# Altium project SR-BMS-Slave-Ver1-RevA.PrjPcb
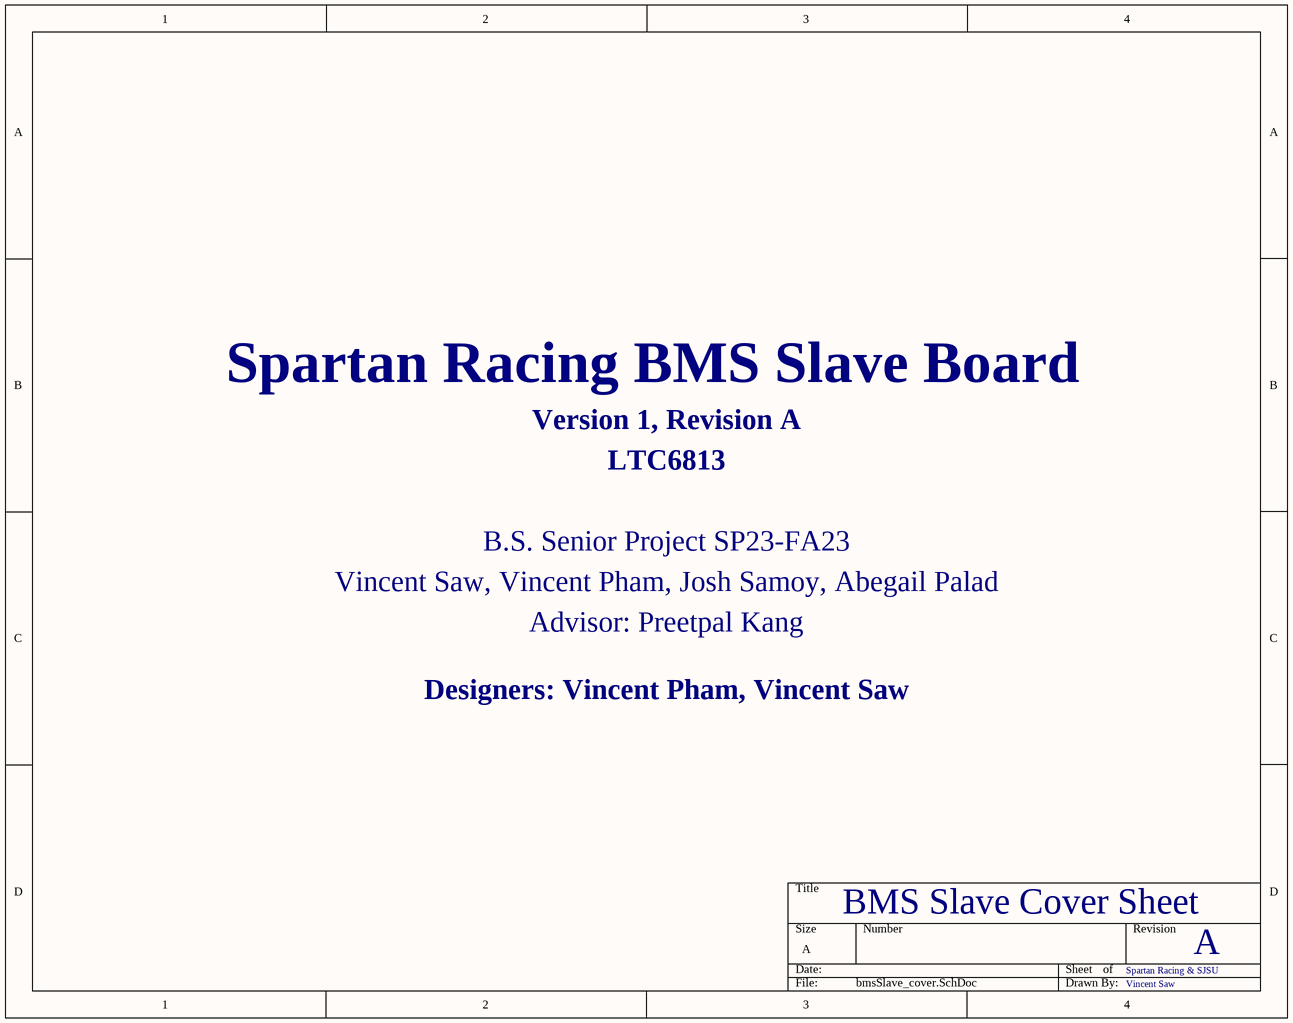
[diagram p0: bmsSlave_cover.SchDoc]
5 sheets, 233 parts. Net scope: global (net labels, ports and power ports of the same name join across sheets).
Board file: bmsSlave.PcbDoc
Sheets:
  bmsSlave_cover.SchDoc
  bmsSlave_main.SchDoc
  bmsSlave_conn.SchDoc
  bmsSlave_cells.SchDoc
  bmsSlave_isospi.SchDoc

## Sheet bmsSlave_cover.SchDoc
size A; SheetNumber: 1; SheetTotal: 5

### Notes on the sheet
- Spartan Racing BMS Slave Board
- Version 1, Revision A
- LTC6813
- B.S. Senior Project SP23-FA23
- Vincent Saw, Vincent Pham, Josh Samoy, Abegail Palad
- Advisor: Preetpal Kang
- Designers: Vincent Pham, Vincent Saw
- BMS Slave Cover Sheet
- Spartan Racing & SJSU
- A
- Vincent Saw

## Sheet bmsSlave_main.SchDoc
size B; SheetNumber: 2; SheetTotal: 4; Designator: R
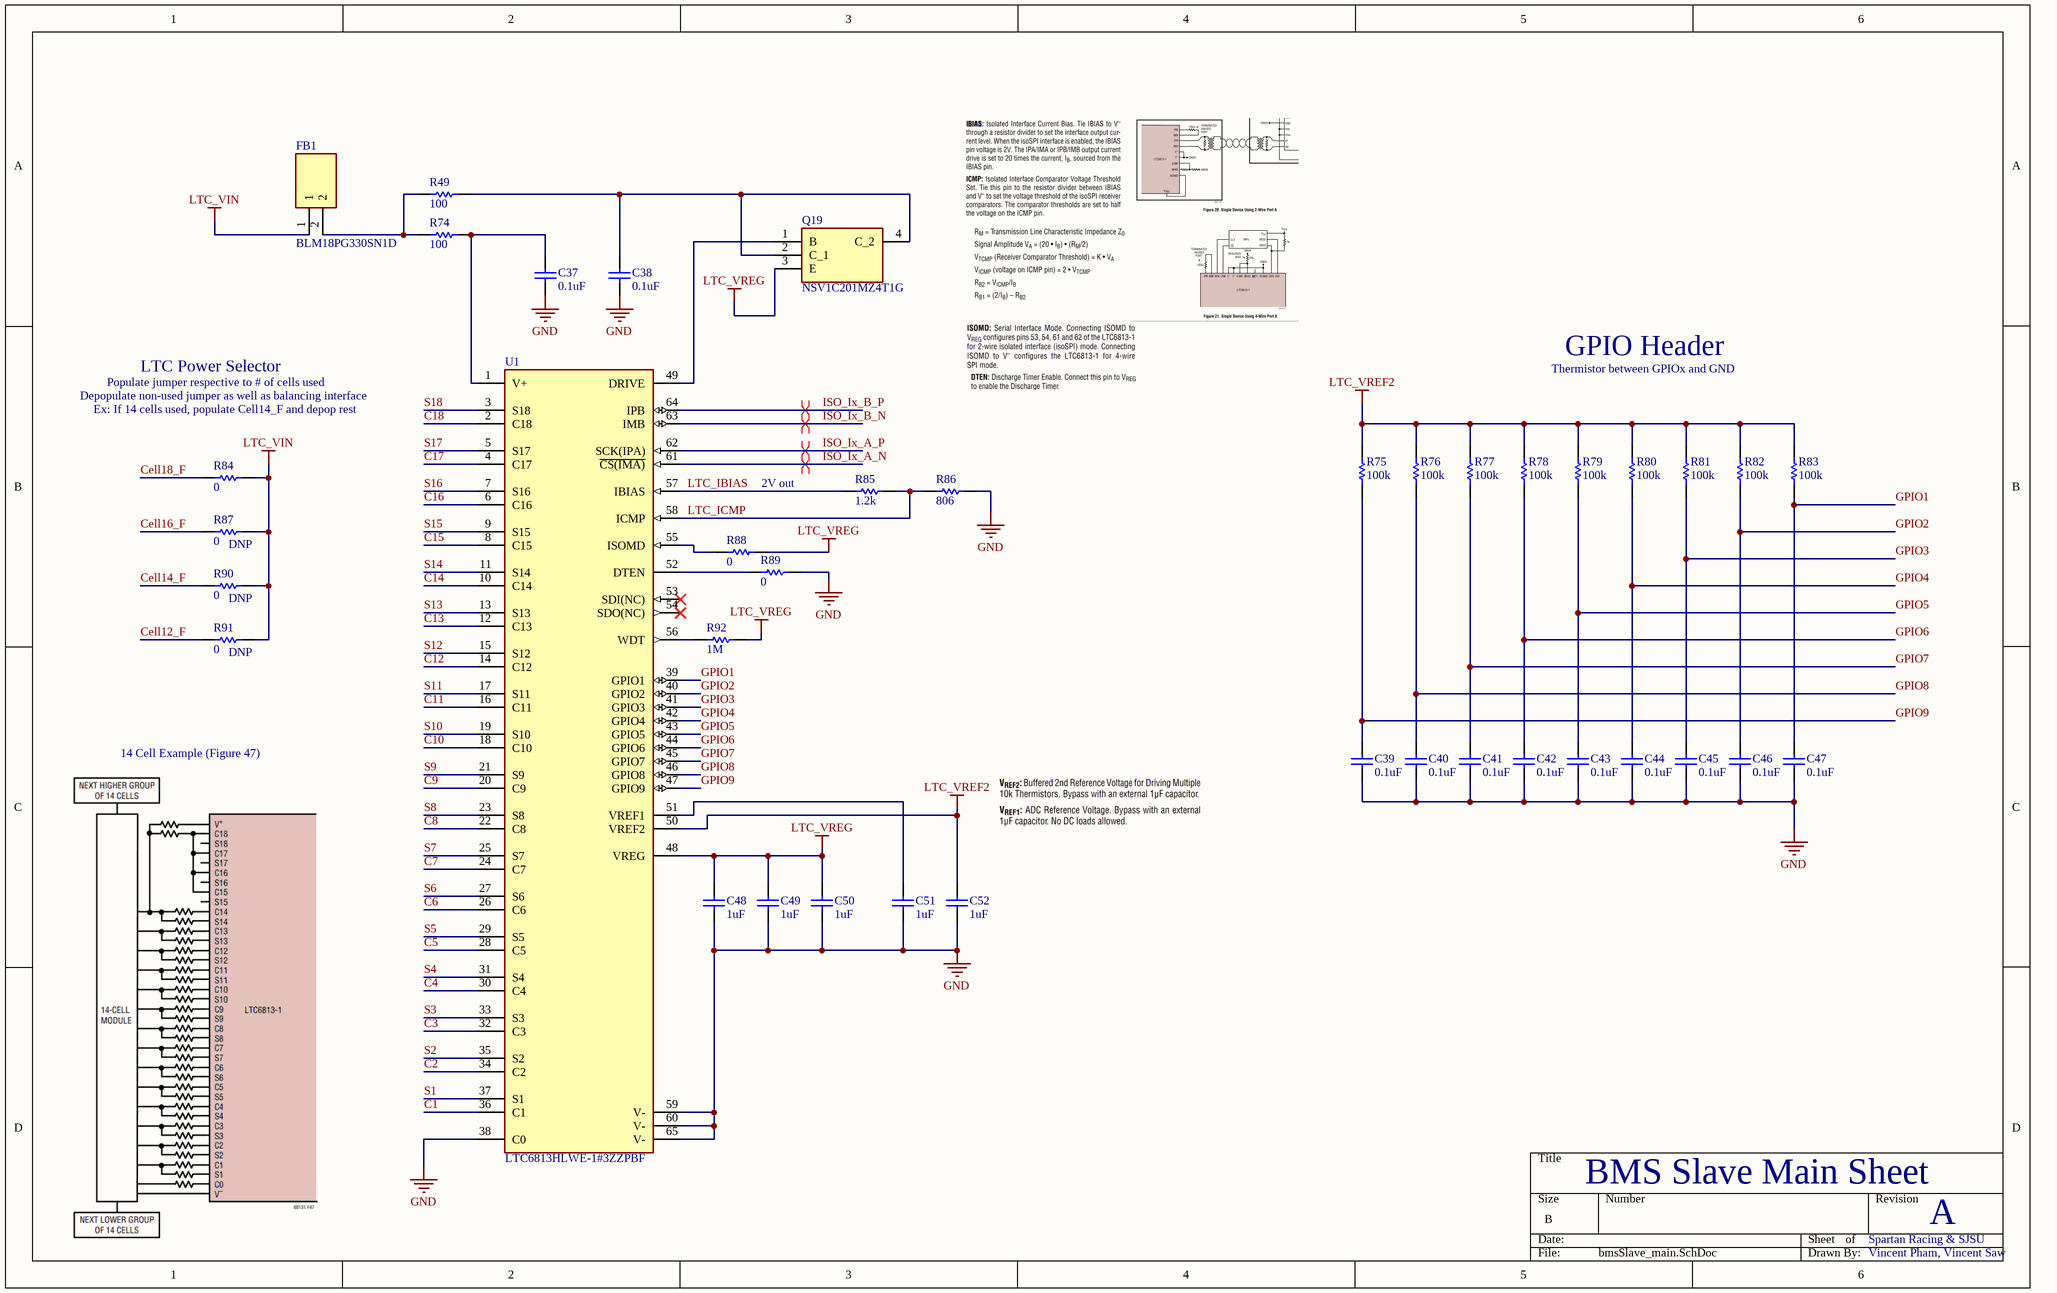
[diagram p1: bmsSlave_main.SchDoc]

### Parts
C37  value 0.1uF  [C0603]  (hidden comment: Capacitor)
C38  value 0.1uF  [C0603]  (hidden comment: Capacitor)
C39  value 0.1uF  [C0603]  (hidden comment: Capacitor)
C40  value 0.1uF  [C0603]  (hidden comment: Capacitor)
C41  value 0.1uF  [C0603]  (hidden comment: Capacitor)
C42  value 0.1uF  [C0603]  (hidden comment: Capacitor)
C43  value 0.1uF  [C0603]  (hidden comment: Capacitor)
C44  value 0.1uF  [C0603]  (hidden comment: Capacitor)
C45  value 0.1uF  [C0603]  (hidden comment: Capacitor)
C46  value 0.1uF  [C0603]  (hidden comment: Capacitor)
C47  value 0.1uF  [C0603]  (hidden comment: Capacitor)
C48  value 1uF  [C0603]  (hidden comment: Capacitor)
C49  value 1uF  [C0603]  (hidden comment: Capacitor)
C50  value 1uF  [C0603]  (hidden comment: Capacitor)
C51  value 1uF  [C0603]  (hidden comment: Capacitor)
C52  value 1uF  [C0603]  (hidden comment: Capacitor)
FB1  BLM18PG330SN1D  [BEADC1608X95N]
Q19  NSV1C201MZ4T1G  [SOT230P700X175-4N]
R49  value 100  [R0603]  (hidden comment: Resistor)
R74  value 100  [R0603]  (hidden comment: Resistor)
R75  value 100k  [R0603]  (hidden comment: Resistor)
R76  value 100k  [R0603]  (hidden comment: Resistor)
R77  value 100k  [R0603]  (hidden comment: Resistor)
R78  value 100k  [R0603]  (hidden comment: Resistor)
R79  value 100k  [R0603]  (hidden comment: Resistor)
R80  value 100k  [R0603]  (hidden comment: Resistor)
R81  value 100k  [R0603]  (hidden comment: Resistor)
R82  value 100k  [R0603]  (hidden comment: Resistor)
R83  value 100k  [R0603]  (hidden comment: Resistor)
R84  value 0  [R0603]  (hidden comment: Resistor)
R85  value 1.2k  [R0603]  (hidden comment: Resistor)
R86  value 806  [R0603]  (hidden comment: Resistor)
R87  value 0  [R0603]  (hidden comment: Resistor)
R88  value 0  [R0603]  (hidden comment: Resistor)
R89  value 0  [R0603]  (hidden comment: Resistor)
R90  value 0  [R0603]  (hidden comment: Resistor)
R91  value 0  [R0603]  (hidden comment: Resistor)
R92  value 1M  [R0603]  (hidden comment: Resistor)
U1  LTC6813HLWE-1#3ZZPBF  [FP-LWE-64-05-08-1982-MFG]

### Nets
GND: C37.2 C38.2 C39.2 C40.2 C41.2 C42.2 C43.2 C44.2 C45.2 C46.2 C47.2 C48.2 C49.2 C50.2 C51.2 C52.2 R86.2 R89.1 U1.38(C0) U1.59(V-) U1.60(V-) U1.65(V-)
LTC_VIN: FB1.1 R84.2 R87.2 R90.2 R91.2
LTC_VREF2: C52.1 R75.2 R76.2 R77.2 R78.2 R79.2 R80.2 R81.2 R82.2 R83.2 U1.50(VREF2)
LTC_VREG: C48.1 C49.1 C50.1 Q19.3(E) R88.1 R92.1 U1.48(VREG)
C1: U1.36(C1)
C2: U1.34(C2)
C3: U1.32(C3)
C4: U1.30(C4)
C5: U1.28(C5)
C6: U1.26(C6)
C7: U1.24(C7)
C8: U1.22(C8)
C9: U1.20(C9)
C10: U1.18(C10)
C11: U1.16(C11)
C12: U1.14(C12)
C13: U1.12(C13)
C14: U1.10(C14)
C15: U1.8(C15)
C16: U1.6(C16)
C17: U1.4(C17)
C18: U1.2(C18)
Cell12_F: R91.1
Cell14_F: R90.1
Cell16_F: R87.1
Cell18_F: R84.1
GPIO1: C47.1 R83.1 U1.39(GPIO1)
GPIO2: C46.1 R82.1 U1.40(GPIO2)
GPIO3: C45.1 R81.1 U1.41(GPIO3)
GPIO4: C44.1 R80.1 U1.42(GPIO4)
GPIO5: C43.1 R79.1 U1.43(GPIO5)
GPIO6: C42.1 R78.1 U1.44(GPIO6)
GPIO7: C41.1 R77.1 U1.45(GPIO7)
GPIO8: C40.1 R76.1 U1.46(GPIO8)
GPIO9: C39.1 R75.1 U1.47(GPIO9)
ISO_Ix_A_N: U1.61(~{CS(IMA)})
ISO_Ix_A_P: U1.62(SCK(IPA))
ISO_Ix_B_N: U1.63(IMB)
ISO_Ix_B_P: U1.64(IPB)
LTC_IBIAS: R85.2 U1.57(IBIAS)
LTC_ICMP: R85.1 R86.1 U1.58(ICMP)
S1: U1.37(S1)
S2: U1.35(S2)
S3: U1.33(S3)
S4: U1.31(S4)
S5: U1.29(S5)
S6: U1.27(S6)
S7: U1.25(S7)
S8: U1.23(S8)
S9: U1.21(S9)
S10: U1.19(S10)
S11: U1.17(S11)
S12: U1.15(S12)
S13: U1.13(S13)
S14: U1.11(S14)
S15: U1.9(S15)
S16: U1.7(S16)
S17: U1.5(S17)
S18: U1.3(S18)
NetC37_1: C37.1 R74.2 U1.1(V+)
NetC38_1: C38.1 Q19.2(C_1) Q19.4(C_2) R49.2
NetC51_1: C51.1 U1.51(VREF1)
NetFB1_2: FB1.2 R49.1 R74.1
NetQ19_1: Q19.1(B) U1.49(DRIVE)
NetR88_2: R88.2 U1.55(ISOMD)
NetR89_2: R89.2 U1.52(DTEN)
NetR92_2: R92.2 U1.56(WDT)

Not connected (* = marked no-connect by the designer): U1 53(SDI(NC))* 54(SDO(NC))*

### Layout directives
differential pair: ISO_Ix_A_N, ISO_Ix_A_P, ISO_Ix_B_N, ISO_Ix_B_P

### Notes on the sheet
- LTC Power Selector
- Thermistor between GPIOx and GND
- GPIO Header
- Depopulate non-used jumper as well as balancing interface
- Ex: If 14 cells used, populate Cell14_F and depop rest
- Populate jumper respective to # of cells used
- 2V out
- (near R87) DNP
- (near R90) DNP
- (near R91) DNP
- 14 Cell Example (Figure 47)
- BMS Slave Main Sheet
- Spartan Racing & SJSU
- A
- Vincent Pham, Vincent Saw

### Library data of the parts
C37-C52 = Capacitor: SimulationGenericComponent: True
FB1 = BLM18PG330SN1D: Ferrite Bead; Manufacturer_Name: Murata Electronics; Datasheet Link: http://www.murata.com/~/media/webrenewal/support/library/catalog/products/emc/emifil/c31e.ashx?la=en-gb; Height: 0.95mm; Manufacturer_Part_Number: BLM18PG330SN1D; Mouser Part Number: 81-BLM18PG330SN1D; Mouser Price/Stock: https://www.mouser.co.uk/ProductDetail/Murata-Electronics/BLM18PG330SN1D?qs=4Avc3lXqH4bdltMAIp8Scg%3D%3D; Arrow Part Number: BLM18PG330SN1D; Arrow Price/Stock: https://www.arrow.com/en/products/blm18pg330sn1d/murata-manufacturing?region=nac
Q19 = NSV1C201MZ4T1G: Transistor; Manufacturer_Name: onsemi; Datasheet Link: http://www.onsemi.com/pub/Collateral/NSS1C201MZ4-D.PDF; Height: 1.75mm; Manufacturer_Part_Number: NSV1C201MZ4T1G; Mouser Part Number: 863-NSV1C201MZ4T1G; Mouser Price/Stock: https://www.mouser.co.uk/ProductDetail/onsemi/NSV1C201MZ4T1G?qs=abmNkq9no6CNkkQTLXtvJQ%3D%3D; Arrow Part Number: NSV1C201MZ4T1G; Arrow Price/Stock: https://www.arrow.com/en/products/nsv1c201mz4t1g/on-semiconductor
R49 R74-R83 R85 R86 R92 = Resistor: TC1: 0; SimulationGenericComponent: True; TC2: 0
R84 R87-R91 = Resistor: SimulationGenericComponent: True; TC1: 0; TC2: 0
U1 = CMP-09132-000002-1: 18 CHANNEL MULTICELL BATTERY STA; Manufacturer: Analog Devices; Number Of Outputs: 1; Min Supply Voltage: 2.7V; Max Junction Temp: +125°C; Number Of Cells: 18; Output Voltage: 5.7V; Standoff Height: 0.05mm; Nominal Supply Current: 3-6.1uA; Automotive Grade: Grade 1; Max Supply Voltage: 3.6V; Temperature: -40°C to +125°C; Temperature Range Low: -40°C; Lead Free: Yes; Device Class L1: Integrated Circuits (ICs); ComponentLink2Description: Datasheet; ComponentLink2URL: https://www.analog.com/media/en/technical-documentation/data-sheets/LTC6813-1.pdf; Height: 1.6mm; Package: LWE-64-05-08-1982; Digikey Description: 18 CHANNEL MULTICELL BATTERY STA; RoHS: TRUE; Category: IC; Octopart: https://octopart.com/ltc6813hlwe-1%233zzpbf-analog+devices-90390400; Temperature Range High: +125°C; Automotive: Yes; Manufacturer Part Number: LTC6813HLWE-1#3ZZPBF; Device Class L3: Battery Management; Device Class L2: Power Management ICs; Ipc Land Pattern Name: QFP50P1200X1200X160-64

## Sheet bmsSlave_conn.SchDoc
size A; SheetNumber: 2; SheetTotal: 4
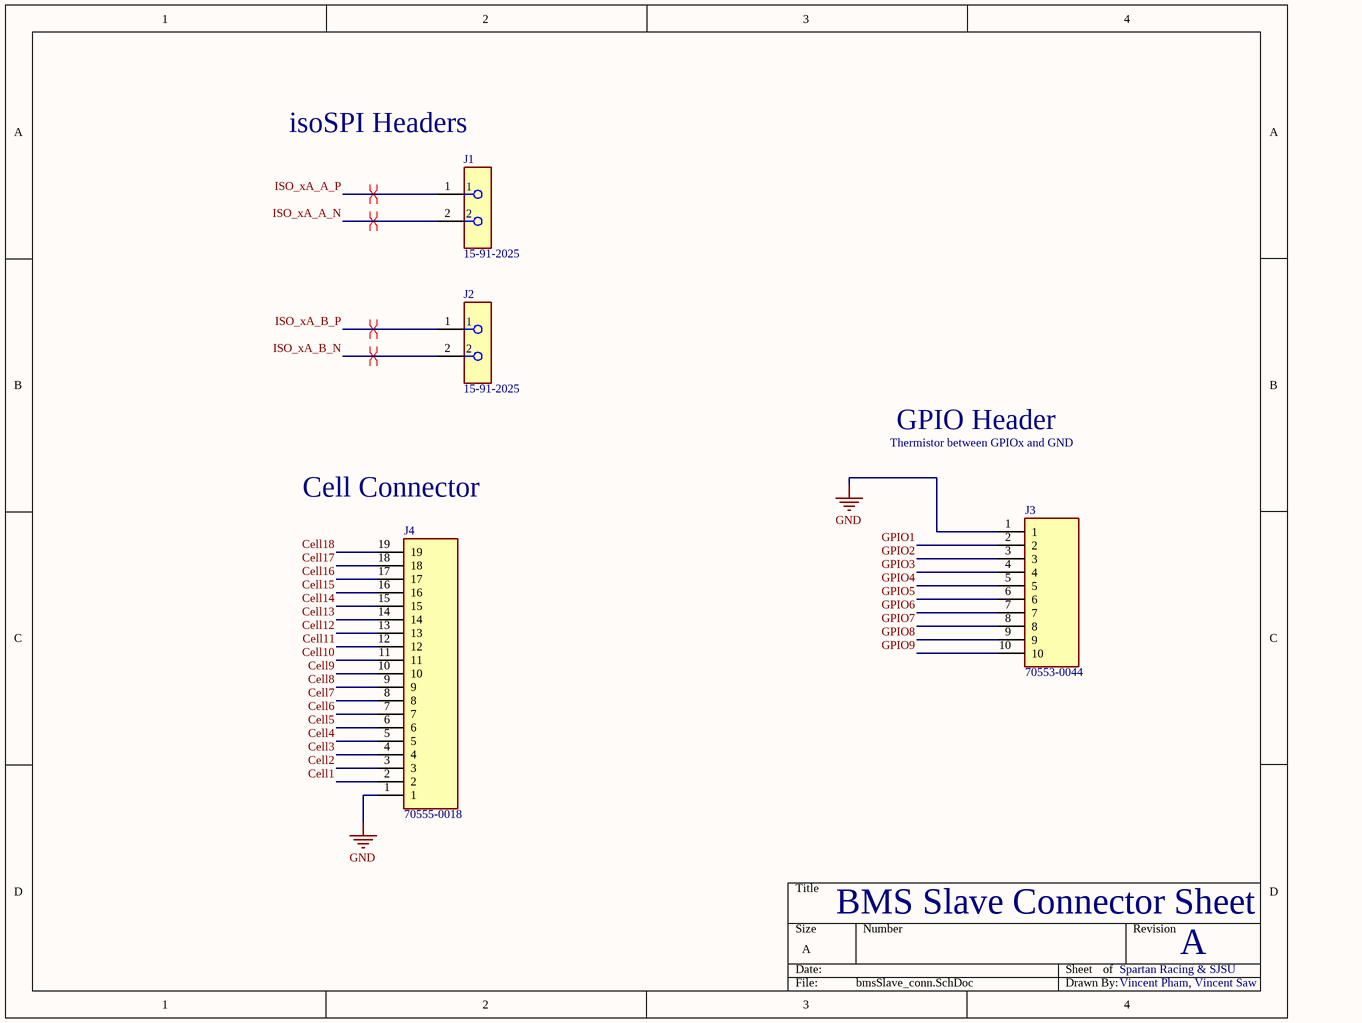
[diagram p2: bmsSlave_conn.SchDoc]

### Parts
J1  15-91-2025  [FP-15-91-2025-MFG]
J2  15-91-2025  [FP-15-91-2025-MFG]
J3  70553-0044  [705550044]
J4  70555-0018  [705550018]

### Nets
GND: J3.1 J4.1
Cell1: J4.2
Cell2: J4.3
Cell3: J4.4
Cell4: J4.5
Cell5: J4.6
Cell6: J4.7
Cell7: J4.8
Cell8: J4.9
Cell9: J4.10
Cell10: J4.11
Cell11: J4.12
Cell12: J4.13
Cell13: J4.14
Cell14: J4.15
Cell15: J4.16
Cell16: J4.17
Cell17: J4.18
Cell18: J4.19
GPIO1: J3.2
GPIO2: J3.3
GPIO3: J3.4
GPIO4: J3.5
GPIO5: J3.6
GPIO6: J3.7
GPIO7: J3.8
GPIO8: J3.9
GPIO9: J3.10
ISO_xA_A_N: J1.2
ISO_xA_A_P: J1.1
ISO_xA_B_N: J2.2
ISO_xA_B_P: J2.1

### Layout directives
differential pair: ISO_xA_A_N, ISO_xA_A_P, ISO_xA_B_N, ISO_xA_B_P

### Notes on the sheet
- isoSPI Headers
- GPIO Header
- (near J4) Cell Connector
- Thermistor between GPIOx and GND
- BMS Slave Connector Sheet
- Spartan Racing & SJSU
- A
- Vincent Pham, Vincent Saw

### Library data of the parts
J1 J2 = CMP-04776-000618-1: CONN HEADER SMD R/A 2POS 2.54MM; Number of Contacts: 2; Voltage Rating: 250V; Max Current Rating: 1.75A; Contact Resistance: 30mR; Current Rating: 3A; Insulation Resistance: 1GR; Gender: Male; Glow Wire Compliant: Non-compliant; Contact Mating Length: 0.24inch; Max Operating Temperature: 105°C; Length: 8.64mm; Color: Black; REACH SVHC: No SVHC; Depth: 13.59mm; ELV: Compliant; Material: Brass; Contact Type: Male Pin; Number of Rows: 1; Number of Positions: 2; Housing Color: Black; Pitch: 2.54mm; Housing Material: Polyester; Flammability Rating: UL94 V-0; Packaging: Rail/Tube; RoHS Compliant: Yes; Radiation Hardening: No; Min Operating Temperature: -40°C; Termination: Solder; Mount: Surface Mount; Contact Plating: Gold; Package Quantity: 1830; Height: 5.56mm; Contact Material: Bronze; Orientation: Right Angle; Number of Circuits: 2; Lead Free: Contains Lead; Voltage Rating (DC): 250V; Series: C-Grid® SL™ 70634; Contact Gender: Male
J3 = 70553-0044: Connector; Manufacturer_Name: Molex; Datasheet Link: https://www.molex.com/pdm_docs/sd/705530044_sd.pdf; Height: 7.12mm; Manufacturer_Part_Number: 70553-0044; Mouser Part Number: 538-70553-0044; Mouser Price/Stock: https://www.mouser.co.uk/ProductDetail/Molex/70553-0044?qs=MYfYmQ4RRgbAysUAVOcSCQ%3D%3D
J4 = 70555-0018: Connector; Manufacturer_Name: Molex; Datasheet Link: https://www.molex.com/pdm_docs/sd/705550018_sd.pdf; Height: 7mm; Manufacturer_Part_Number: 70555-0018

## Sheet bmsSlave_cells.SchDoc
size B; SheetNumber: 3; SheetTotal: 4
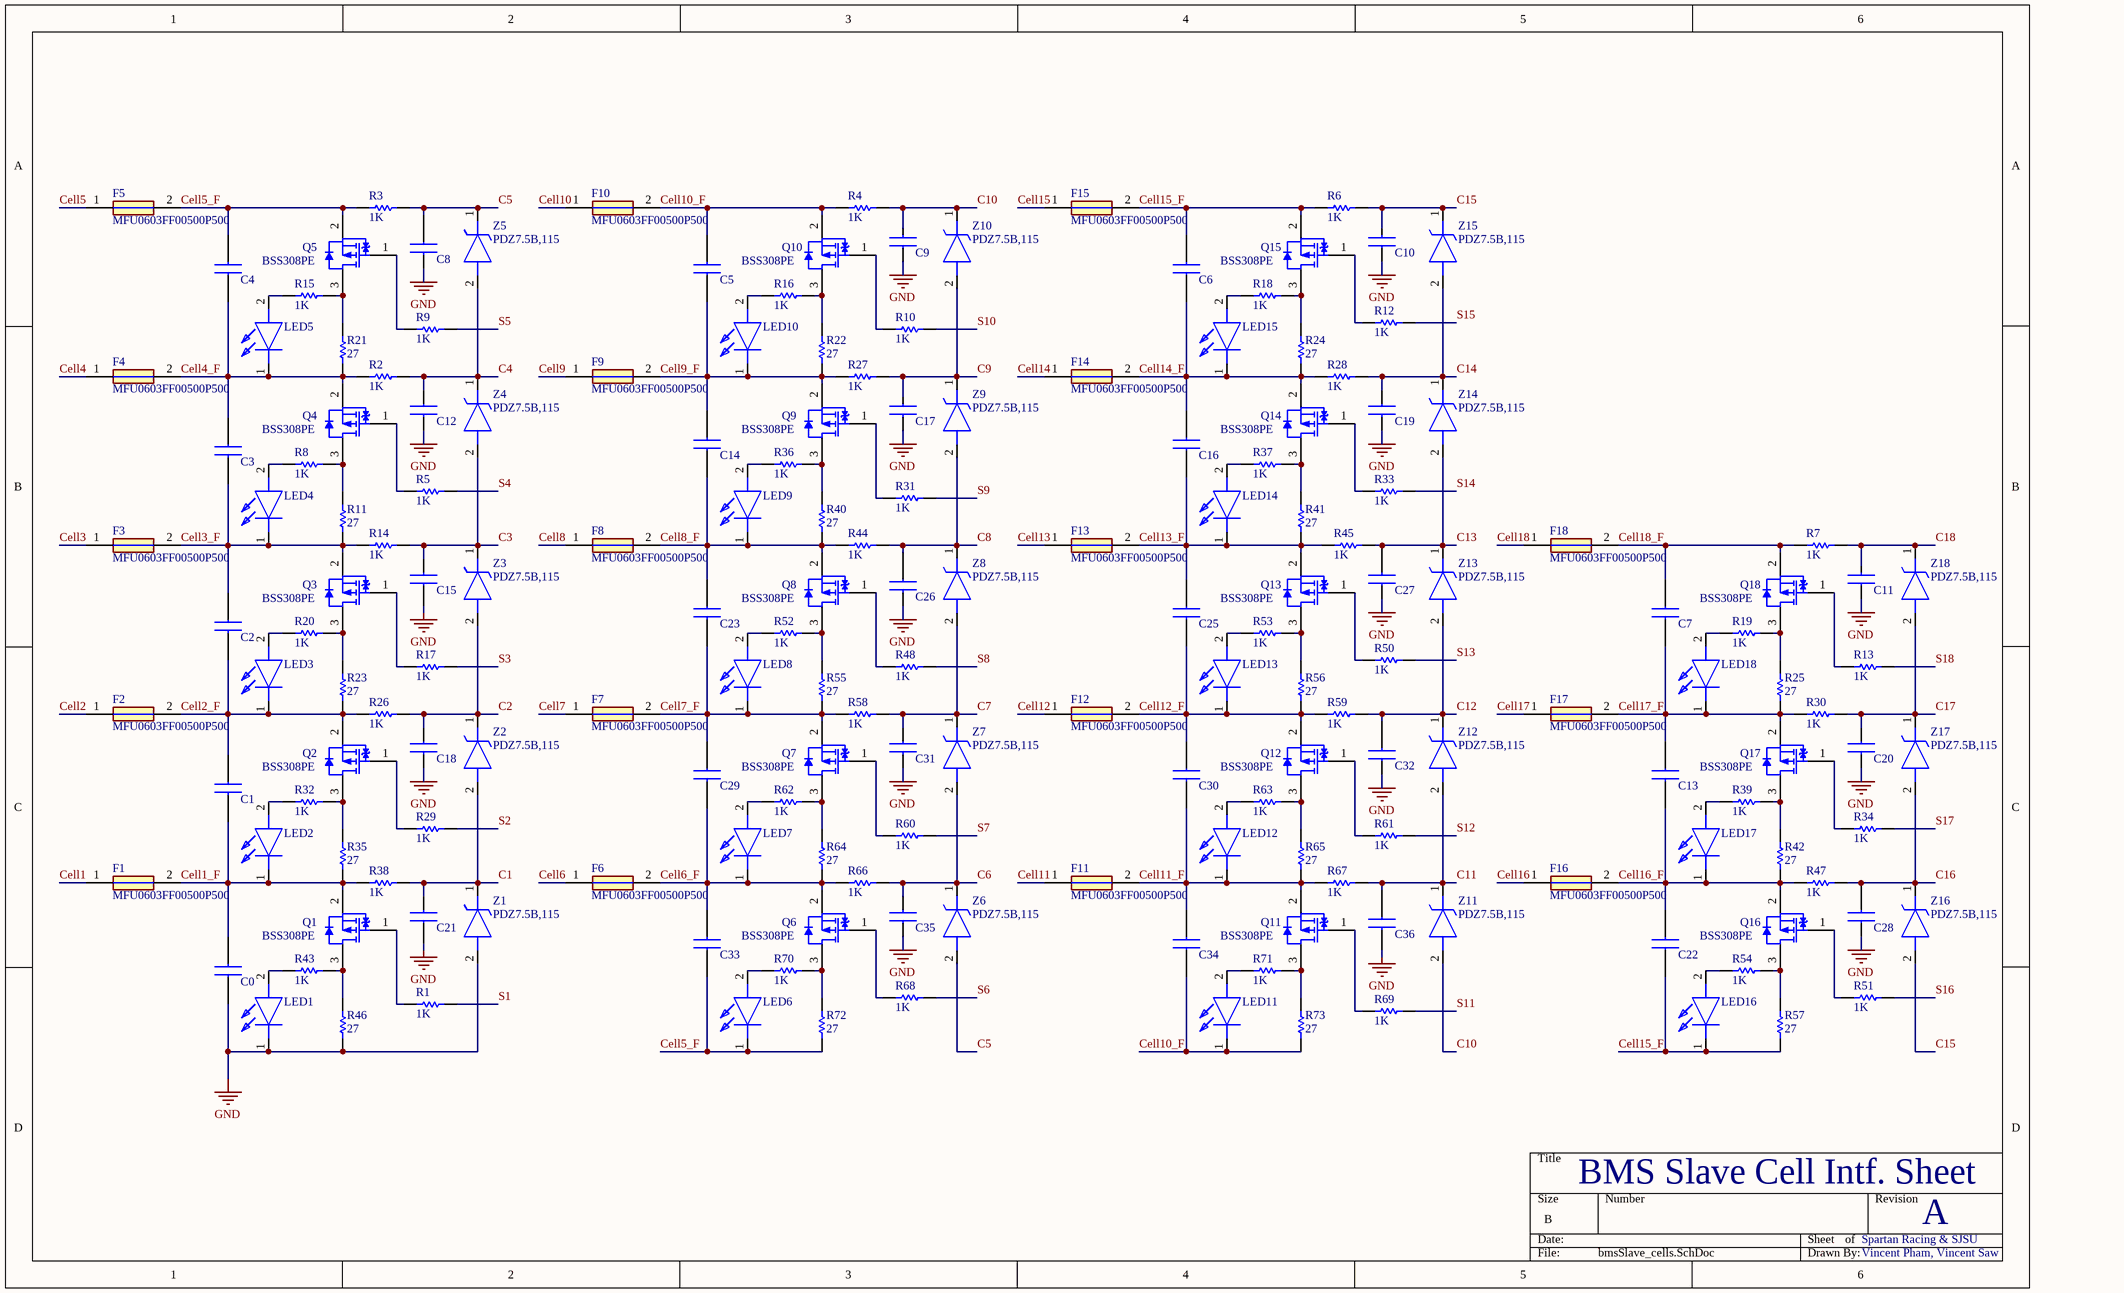
[diagram p3: bmsSlave_cells.SchDoc]

### Parts
C0  885382207009  [C0603]  (value not drawn)
C1  885382207009  [C0603]  (value not drawn)
C2  885382207009  [C0603]  (value not drawn)
C3  885382207009  [C0603]  (value not drawn)
C4  885382207009  [C0603]  (value not drawn)
C5  885382207009  [C0603]  (value not drawn)
C6  885382207009  [C0603]  (value not drawn)
C7  885382207009  [C0603]  (value not drawn)
C8  885382207009  [C0603]  (value not drawn)
C9  885382207009  [C0603]  (value not drawn)
C10  885382207009  [C0603]  (value not drawn)
C11  885382207009  [C0603]  (value not drawn)
C12  885382207009  [C0603]  (value not drawn)
C13  885382207009  [C0603]  (value not drawn)
C14  885382207009  [C0603]  (value not drawn)
C15  885382207009  [C0603]  (value not drawn)
C16  885382207009  [C0603]  (value not drawn)
C17  885382207009  [C0603]  (value not drawn)
C18  885382207009  [C0603]  (value not drawn)
C19  885382207009  [C0603]  (value not drawn)
C20  885382207009  [C0603]  (value not drawn)
C21  885382207009  [C0603]  (value not drawn)
C22  885382207009  [C0603]  (value not drawn)
C23  885382207009  [C0603]  (value not drawn)
C25  885382207009  [C0603]  (value not drawn)
C26  885382207009  [C0603]  (value not drawn)
C27  885382207009  [C0603]  (value not drawn)
C28  885382207009  [C0603]  (value not drawn)
C29  885382207009  [C0603]  (value not drawn)
C30  885382207009  [C0603]  (value not drawn)
C31  885382207009  [C0603]  (value not drawn)
C32  885382207009  [C0603]  (value not drawn)
C33  885382207009  [C0603]  (value not drawn)
C34  885382207009  [C0603]  (value not drawn)
C35  885382207009  [C0603]  (value not drawn)
C36  885382207009  [C0603]  (value not drawn)
F1  MFU0603FF00500P500  [FUSC1608X55N]
F2  MFU0603FF00500P500  [FUSC1608X55N]
F3  MFU0603FF00500P500  [FUSC1608X55N]
F4  MFU0603FF00500P500  [FUSC1608X55N]
F5  MFU0603FF00500P500  [FUSC1608X55N]
F6  MFU0603FF00500P500  [FUSC1608X55N]
F7  MFU0603FF00500P500  [FUSC1608X55N]
F8  MFU0603FF00500P500  [FUSC1608X55N]
F9  MFU0603FF00500P500  [FUSC1608X55N]
F10  MFU0603FF00500P500  [FUSC1608X55N]
F11  MFU0603FF00500P500  [FUSC1608X55N]
F12  MFU0603FF00500P500  [FUSC1608X55N]
F13  MFU0603FF00500P500  [FUSC1608X55N]
F14  MFU0603FF00500P500  [FUSC1608X55N]
F15  MFU0603FF00500P500  [FUSC1608X55N]
F16  MFU0603FF00500P500  [FUSC1608X55N]
F17  MFU0603FF00500P500  [FUSC1608X55N]
F18  MFU0603FF00500P500  [FUSC1608X55N]
LED1  LS_L29K-G1H2-1  [LEDC1308X67N]  (value not drawn)
LED2  LS_L29K-G1H2-1  [LEDC1308X67N]  (value not drawn)
LED3  LS_L29K-G1H2-1  [LEDC1308X67N]  (value not drawn)
LED4  LS_L29K-G1H2-1  [LEDC1308X67N]  (value not drawn)
LED5  LS_L29K-G1H2-1  [LEDC1308X67N]  (value not drawn)
LED6  LS_L29K-G1H2-1  [LEDC1308X67N]  (value not drawn)
LED7  LS_L29K-G1H2-1  [LEDC1308X67N]  (value not drawn)
LED8  LS_L29K-G1H2-1  [LEDC1308X67N]  (value not drawn)
LED9  LS_L29K-G1H2-1  [LEDC1308X67N]  (value not drawn)
LED10  LS_L29K-G1H2-1  [LEDC1308X67N]  (value not drawn)
LED11  LS_L29K-G1H2-1  [LEDC1308X67N]  (value not drawn)
LED12  LS_L29K-G1H2-1  [LEDC1308X67N]  (value not drawn)
LED13  LS_L29K-G1H2-1  [LEDC1308X67N]  (value not drawn)
LED14  LS_L29K-G1H2-1  [LEDC1308X67N]  (value not drawn)
LED15  LS_L29K-G1H2-1  [LEDC1308X67N]  (value not drawn)
LED16  LS_L29K-G1H2-1  [LEDC1308X67N]  (value not drawn)
LED17  LS_L29K-G1H2-1  [LEDC1308X67N]  (value not drawn)
LED18  LS_L29K-G1H2-1  [LEDC1308X67N]  (value not drawn)
Q1  BSS308PE  [INF-PG-SOT23_L]
Q2  BSS308PE  [INF-PG-SOT23_L]
Q3  BSS308PE  [INF-PG-SOT23_L]
Q4  BSS308PE  [INF-PG-SOT23_L]
Q5  BSS308PE  [INF-PG-SOT23_L]
Q6  BSS308PE  [INF-PG-SOT23_L]
Q7  BSS308PE  [INF-PG-SOT23_L]
Q8  BSS308PE  [INF-PG-SOT23_L]
Q9  BSS308PE  [INF-PG-SOT23_L]
Q10  BSS308PE  [INF-PG-SOT23_L]
Q11  BSS308PE  [INF-PG-SOT23_L]
Q12  BSS308PE  [INF-PG-SOT23_L]
Q13  BSS308PE  [INF-PG-SOT23_L]
Q14  BSS308PE  [INF-PG-SOT23_L]
Q15  BSS308PE  [INF-PG-SOT23_L]
Q16  BSS308PE  [INF-PG-SOT23_L]
Q17  BSS308PE  [INF-PG-SOT23_L]
Q18  BSS308PE  [INF-PG-SOT23_L]
R1  value 1K  [R0603]  (hidden comment: Resistor)
R2  value 1K  [R0603]  (hidden comment: Resistor)
R3  value 1K  [R0603]  (hidden comment: Resistor)
R4  value 1K  [R0603]  (hidden comment: Resistor)
R5  value 1K  [R0603]  (hidden comment: Resistor)
R6  value 1K  [R0603]  (hidden comment: Resistor)
R7  value 1K  [R0603]  (hidden comment: Resistor)
R8  value 1K  [R0603]  (hidden comment: Resistor)
R9  value 1K  [R0603]  (hidden comment: Resistor)
R10  value 1K  [R0603]  (hidden comment: Resistor)
R11  value 27  [R2512]  (hidden comment: Resistor)
R12  value 1K  [R0603]  (hidden comment: Resistor)
R13  value 1K  [R0603]  (hidden comment: Resistor)
R14  value 1K  [R0603]  (hidden comment: Resistor)
R15  value 1K  [R0603]  (hidden comment: Resistor)
R16  value 1K  [R0603]  (hidden comment: Resistor)
R17  value 1K  [R0603]  (hidden comment: Resistor)
R18  value 1K  [R0603]  (hidden comment: Resistor)
R19  value 1K  [R0603]  (hidden comment: Resistor)
R20  value 1K  [R0603]  (hidden comment: Resistor)
R21  value 27  [R2512]  (hidden comment: Resistor)
R22  value 27  [R2512]  (hidden comment: Resistor)
R23  value 27  [R2512]  (hidden comment: Resistor)
R24  value 27  [R2512]  (hidden comment: Resistor)
R25  value 27  [R2512]  (hidden comment: Resistor)
R26  value 1K  [R0603]  (hidden comment: Resistor)
R27  value 1K  [R0603]  (hidden comment: Resistor)
R28  value 1K  [R0603]  (hidden comment: Resistor)
R29  value 1K  [R0603]  (hidden comment: Resistor)
R30  value 1K  [R0603]  (hidden comment: Resistor)
R31  value 1K  [R0603]  (hidden comment: Resistor)
R32  value 1K  [R0603]  (hidden comment: Resistor)
R33  value 1K  [R0603]  (hidden comment: Resistor)
R34  value 1K  [R0603]  (hidden comment: Resistor)
R35  value 27  [R2512]  (hidden comment: Resistor)
R36  value 1K  [R0603]  (hidden comment: Resistor)
R37  value 1K  [R0603]  (hidden comment: Resistor)
R38  value 1K  [R0603]  (hidden comment: Resistor)
R39  value 1K  [R0603]  (hidden comment: Resistor)
R40  value 27  [R2512]  (hidden comment: Resistor)
R41  value 27  [R2512]  (hidden comment: Resistor)
R42  value 27  [R2512]  (hidden comment: Resistor)
R43  value 1K  [R0603]  (hidden comment: Resistor)
R44  value 1K  [R0603]  (hidden comment: Resistor)
R45  value 1K  [R0603]  (hidden comment: Resistor)
R46  value 27  [R2512]  (hidden comment: Resistor)
R47  value 1K  [R0603]  (hidden comment: Resistor)
R48  value 1K  [R0603]  (hidden comment: Resistor)
R50  value 1K  [R0603]  (hidden comment: Resistor)
R51  value 1K  [R0603]  (hidden comment: Resistor)
R52  value 1K  [R0603]  (hidden comment: Resistor)
R53  value 1K  [R0603]  (hidden comment: Resistor)
R54  value 1K  [R0603]  (hidden comment: Resistor)
R55  value 27  [R2512]  (hidden comment: Resistor)
R56  value 27  [R2512]  (hidden comment: Resistor)
R57  value 27  [R2512]  (hidden comment: Resistor)
R58  value 1K  [R0603]  (hidden comment: Resistor)
R59  value 1K  [R0603]  (hidden comment: Resistor)
R60  value 1K  [R0603]  (hidden comment: Resistor)
R61  value 1K  [R0603]  (hidden comment: Resistor)
R62  value 1K  [R0603]  (hidden comment: Resistor)
R63  value 1K  [R0603]  (hidden comment: Resistor)
R64  value 27  [R2512]  (hidden comment: Resistor)
R65  value 27  [R2512]  (hidden comment: Resistor)
R66  value 1K  [R0603]  (hidden comment: Resistor)
R67  value 1K  [R0603]  (hidden comment: Resistor)
R68  value 1K  [R0603]  (hidden comment: Resistor)
R69  value 1K  [R0603]  (hidden comment: Resistor)
R70  value 1K  [R0603]  (hidden comment: Resistor)
R71  value 1K  [R0603]  (hidden comment: Resistor)
R72  value 27  [R2512]  (hidden comment: Resistor)
R73  value 27  [R2512]  (hidden comment: Resistor)
Z1  PDZ7.5B,115  [SOD2512X110N]
Z2  PDZ7.5B,115  [SOD2512X110N]
Z3  PDZ7.5B,115  [SOD2512X110N]
Z4  PDZ7.5B,115  [SOD2512X110N]
Z5  PDZ7.5B,115  [SOD2512X110N]
Z6  PDZ7.5B,115  [SOD2512X110N]
Z7  PDZ7.5B,115  [SOD2512X110N]
Z8  PDZ7.5B,115  [SOD2512X110N]
Z9  PDZ7.5B,115  [SOD2512X110N]
Z10  PDZ7.5B,115  [SOD2512X110N]
Z11  PDZ7.5B,115  [SOD2512X110N]
Z12  PDZ7.5B,115  [SOD2512X110N]
Z13  PDZ7.5B,115  [SOD2512X110N]
Z14  PDZ7.5B,115  [SOD2512X110N]
Z15  PDZ7.5B,115  [SOD2512X110N]
Z16  PDZ7.5B,115  [SOD2512X110N]
Z17  PDZ7.5B,115  [SOD2512X110N]
Z18  PDZ7.5B,115  [SOD2512X110N]

### Nets
GND: C0.1 C8.1 C9.1 C10.1 C11.1 C12.1 C15.1 C17.1 C18.1 C19.1 C20.1 C21.1 C26.1 C27.1 C28.1 C31.1 C32.1 C35.1 C36.1 LED1.1(K) R46.2 Z1.2(A)
C1: C21.2 R38.1 Z1.1(K) Z2.2(A)
C2: C18.2 R26.1 Z2.1(K) Z3.2(A)
C3: C15.2 R14.1 Z3.1(K) Z4.2(A)
C4: C12.2 R2.1 Z4.1(K) Z5.2(A)
C5: C8.2 R3.1 Z5.1(K) Z6.2(A)
C6: C35.2 R66.1 Z6.1(K) Z7.2(A)
C7: C31.2 R58.1 Z7.1(K) Z8.2(A)
C8: C26.2 R44.1 Z8.1(K) Z9.2(A)
C9: C17.2 R27.1 Z9.1(K) Z10.2(A)
C10: C9.2 R4.1 Z10.1(K) Z11.2(A)
C11: C36.2 R67.1 Z11.1(K) Z12.2(A)
C12: C32.2 R59.1 Z12.1(K) Z13.2(A)
C13: C27.2 R45.1 Z13.1(K) Z14.2(A)
C14: C19.2 R28.1 Z14.1(K) Z15.2(A)
C15: C10.2 R6.1 Z15.1(K) Z16.2(A)
C16: C28.2 R47.1 Z16.1(K) Z17.2(A)
C17: C20.2 R30.1 Z17.1(K) Z18.2(A)
C18: C11.2 R7.1 Z18.1(K)
Cell1: F1.1
Cell1_F: C0.2 C1.1 F1.2 LED2.1(K) Q1.2(SOURCE) R35.2 R38.2
Cell2: F2.1
Cell2_F: C1.2 C2.1 F2.2 LED3.1(K) Q2.2(SOURCE) R23.2 R26.2
Cell3: F3.1
Cell3_F: C2.2 C3.1 F3.2 LED4.1(K) Q3.2(SOURCE) R11.2 R14.2
Cell4: F4.1
Cell4_F: C3.2 C4.1 F4.2 LED5.1(K) Q4.2(SOURCE) R2.2 R21.2
Cell5: F5.1
Cell5_F: C4.2 C33.1 F5.2 LED6.1(K) Q5.2(SOURCE) R3.2 R72.2
Cell6: F6.1
Cell6_F: C29.1 C33.2 F6.2 LED7.1(K) Q6.2(SOURCE) R64.2 R66.2
Cell7: F7.1
Cell7_F: C23.1 C29.2 F7.2 LED8.1(K) Q7.2(SOURCE) R55.2 R58.2
Cell8: F8.1
Cell8_F: C14.1 C23.2 F8.2 LED9.1(K) Q8.2(SOURCE) R40.2 R44.2
Cell9: F9.1
Cell9_F: C5.1 C14.2 F9.2 LED10.1(K) Q9.2(SOURCE) R22.2 R27.2
Cell10: F10.1
Cell10_F: C5.2 C34.1 F10.2 LED11.1(K) Q10.2(SOURCE) R4.2 R73.2
Cell11: F11.1
Cell11_F: C30.1 C34.2 F11.2 LED12.1(K) Q11.2(SOURCE) R65.2 R67.2
Cell12: F12.1
Cell12_F: C25.1 C30.2 F12.2 LED13.1(K) Q12.2(SOURCE) R56.2 R59.2
Cell13: F13.1
Cell13_F: C16.1 C25.2 F13.2 LED14.1(K) Q13.2(SOURCE) R41.2 R45.2
Cell14: F14.1
Cell14_F: C6.1 C16.2 F14.2 LED15.1(K) Q14.2(SOURCE) R24.2 R28.2
Cell15: F15.1
Cell15_F: C6.2 C22.1 F15.2 LED16.1(K) Q15.2(SOURCE) R6.2 R57.2
Cell16: F16.1
Cell16_F: C13.1 C22.2 F16.2 LED17.1(K) Q16.2(SOURCE) R42.2 R47.2
Cell17: F17.1
Cell17_F: C7.1 C13.2 F17.2 LED18.1(K) Q17.2(SOURCE) R25.2 R30.2
Cell18: F18.1
Cell18_F: C7.2 F18.2 Q18.2(SOURCE) R7.2
S1: R1.1
S2: R29.1
S3: R17.1
S4: R5.1
S5: R9.1
S6: R68.1
S7: R60.1
S8: R48.1
S9: R31.1
S10: R10.1
S11: R69.1
S12: R61.1
S13: R50.1
S14: R33.1
S15: R12.1
S16: R51.1
S17: R34.1
S18: R13.1
NetLED1_2: LED1.2(A) R43.2
NetLED2_2: LED2.2(A) R32.2
NetLED3_2: LED3.2(A) R20.2
NetLED4_2: LED4.2(A) R8.2
NetLED5_2: LED5.2(A) R15.2
NetLED6_2: LED6.2(A) R70.2
NetLED7_2: LED7.2(A) R62.2
NetLED8_2: LED8.2(A) R52.2
NetLED9_2: LED9.2(A) R36.2
NetLED10_2: LED10.2(A) R16.2
NetLED11_2: LED11.2(A) R71.2
NetLED12_2: LED12.2(A) R63.2
NetLED13_2: LED13.2(A) R53.2
NetLED14_2: LED14.2(A) R37.2
NetLED15_2: LED15.2(A) R18.2
NetLED16_2: LED16.2(A) R54.2
NetLED17_2: LED17.2(A) R39.2
NetLED18_2: LED18.2(A) R19.2
NetQ1_1: Q1.1(GATE) R1.2
NetQ1_3: Q1.3(DRAIN) R43.1 R46.1
NetQ2_1: Q2.1(GATE) R29.2
NetQ2_3: Q2.3(DRAIN) R32.1 R35.1
NetQ3_1: Q3.1(GATE) R17.2
NetQ3_3: Q3.3(DRAIN) R20.1 R23.1
NetQ4_1: Q4.1(GATE) R5.2
NetQ4_3: Q4.3(DRAIN) R8.1 R11.1
NetQ5_1: Q5.1(GATE) R9.2
NetQ5_3: Q5.3(DRAIN) R15.1 R21.1
NetQ6_1: Q6.1(GATE) R68.2
NetQ6_3: Q6.3(DRAIN) R70.1 R72.1
NetQ7_1: Q7.1(GATE) R60.2
NetQ7_3: Q7.3(DRAIN) R62.1 R64.1
NetQ8_1: Q8.1(GATE) R48.2
NetQ8_3: Q8.3(DRAIN) R52.1 R55.1
NetQ9_1: Q9.1(GATE) R31.2
NetQ9_3: Q9.3(DRAIN) R36.1 R40.1
NetQ10_1: Q10.1(GATE) R10.2
NetQ10_3: Q10.3(DRAIN) R16.1 R22.1
NetQ11_1: Q11.1(GATE) R69.2
NetQ11_3: Q11.3(DRAIN) R71.1 R73.1
NetQ12_1: Q12.1(GATE) R61.2
NetQ12_3: Q12.3(DRAIN) R63.1 R65.1
NetQ13_1: Q13.1(GATE) R50.2
NetQ13_3: Q13.3(DRAIN) R53.1 R56.1
NetQ14_1: Q14.1(GATE) R33.2
NetQ14_3: Q14.3(DRAIN) R37.1 R41.1
NetQ15_1: Q15.1(GATE) R12.2
NetQ15_3: Q15.3(DRAIN) R18.1 R24.1
NetQ16_1: Q16.1(GATE) R51.2
NetQ16_3: Q16.3(DRAIN) R54.1 R57.1
NetQ17_1: Q17.1(GATE) R34.2
NetQ17_3: Q17.3(DRAIN) R39.1 R42.1
NetQ18_1: Q18.1(GATE) R13.2
NetQ18_3: Q18.3(DRAIN) R19.1 R25.1

### Notes on the sheet
- BMS Slave Cell Intf. Sheet
- Spartan Racing & SJSU
- A
- Vincent Pham, Vincent Saw

### Library data of the parts
C0-C23 C25-C36 = 885382207009: Multilayer Ceramic Chip Capacitor WCAP-CSST Series 0805 10000pF X7R0805103K100DFCT1S000; Manufacturer_Name: Wurth Elektronik; Geometry.Height: 1.35mm; Mouser Part Number: 710-885382207009; Mouser Price/Stock: https://www.mouser.co.uk/ProductDetail/Wurth-Elektronik/885382207009?qs=0lSvoLzn4L%2FLliJ98PmFYg%3D%3D; Manufacturer_Part_Number: 885382207009; Datasheet Link: https://katalog.we-online.com/pbs/datasheet/885382207009.pdf
F1-F18 = MFU0603FF00500P500: Fuse; Manufacturer_Name: Vishay; Datasheet Link: https://componentsearchengine.com/Datasheets/1/MFU0603FF00500P500.pdf; Height: 0.55mm; Manufacturer_Part_Number: MFU0603FF00500P500; Mouser Part Number: 594-MFU0603-FF-0.5; Mouser Price/Stock: https://www.mouser.co.uk/ProductDetail/Vishay-Beyschlag/MFU0603FF00500P500?qs=Ok6sVjDQtqZISHXP1RFN1Q%3D%3D
LED1-LED18 = LS_L29K-G1H2-1: LED; Manufacturer_Name: OSRAM; Manufacturer_Part_Number: LS L29K-G1H2-1; Datasheet Link: https://dammedia.osram.info/media/resource/hires/osram-dam-5662679/LS%20L29K_EN.pdf; Height: 0.67mm; Mouser Part Number: 720-LSL29K-G1H2-1-Z; Mouser Price/Stock: https://www.mouser.com/Search/Refine.aspx?Keyword=720-LSL29K-G1H2-1-Z; Arrow Part Number: LS L29K-G1H2-1; Arrow Price/Stock: https://www.arrow.com/en/products/ls-l29k-g1h2-1/osram-opto-semiconductors
Q1-Q18 = CMP-1099-00030-1: P-Channel OptiMOS P3 Small-Signal-Transistor, -30 V VDS, -2 A ID, -55 to 150 degC, PG-SOT23, Reel, Green; Manufacturer: Infineon; RDS (on) (max) (@4.5V): 130Â mOhm; Pto t (max): 0.5Â W; ID (max): -2Â A; IDpuls (max): -8Â A; VDS (max): -30Â V; VGS(th) (min): -2Â V; Green: TRUE; RDS (on) (max): 80Â mOhm; QG: -5Â nC; Rth: 250Â K/W; VGS(th) (max): -1Â V; PartNumber: BSS308PE; ComponentLink3Description: Package Specification; PackageDescription: 3-Pin Small Outline Transistor Package, 2.9 x 1.3 mm Body, 0.95 mm Pitch; Mounting Technology: Surface Mount; Packing: Reel; PackageReference: PG-SOT23; PackageVersion: Apr-08; Halogen-free: TRUE; DatasheetVersion: Rev. 2.03; ComponentLink2URL: http://www.infineon.com/dgdl/BSS308PE_Rev23_.pdf?folderId=db3a304314dca38901154a72e3951a65&fileId=db3a304330f686060131099c80400073; ComponentLink2Description: Datasheet; ComponentLink1Description: Manufacturer URL; ComponentLink1URL: http://www.infineon.com/; ComponentLink3URL: http://www.infineon.com/dgdl/SOT23-Package_Overview.pdf?folderId=db3a30431936bc4b0119532290053c66&fileId=db3a30431936bc4b0119533468123c85
R1-R48 R50-R73 = Resistor: TC1: 0; SimulationGenericComponent: True; TC2: 0
  R9: Supplier: Future Electronics; Supplier Part Number: 1029290
Z1-Z18 = PDZ7.5B,115: Zener Diode; Manufacturer_Name: Nexperia; Datasheet Link: https://assets.nexperia.com/documents/data-sheet/PDZ-B_SER.pdf; Height: 1.1mm; Manufacturer_Part_Number: PDZ7.5B,115; Mouser Part Number: 771-PDZ75B115; Mouser Price/Stock: https://www.mouser.co.uk/ProductDetail/Nexperia/PDZ75B115?qs=LOCUfHb8d9tcy1Hn7wNhcw%3D%3D; Arrow Part Number: PDZ7.5B,115; Arrow Price/Stock: https://www.arrow.com/en/products/pdz7.5b115/nexperia

## Sheet bmsSlave_isospi.SchDoc
size A; SheetNumber: 4; SheetTotal: 4
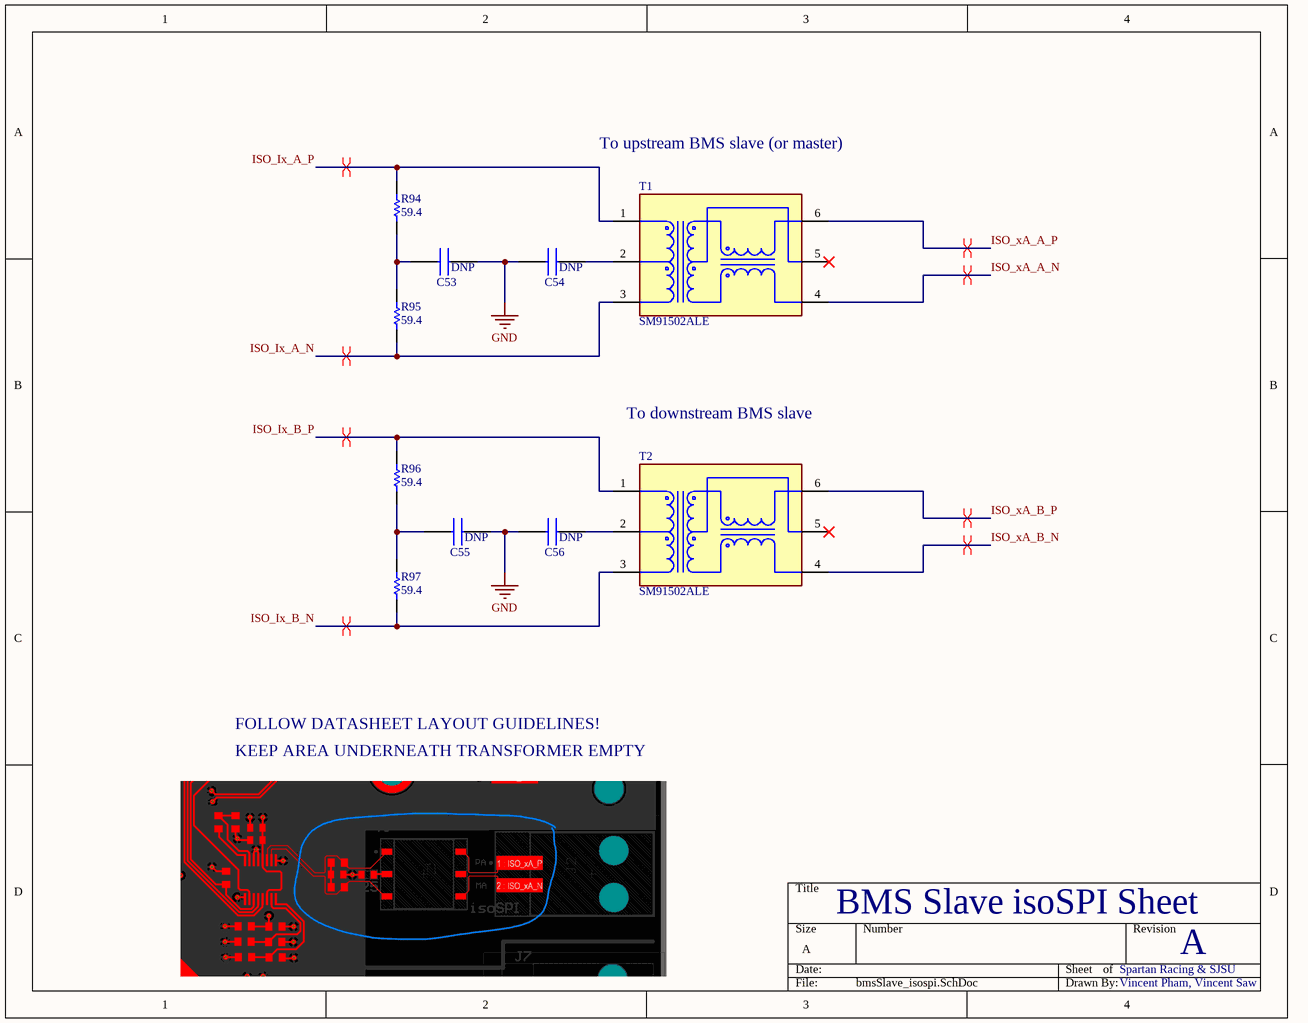
[diagram p4: bmsSlave_isospi.SchDoc]

### Parts
C53  885382207009  [C0603]  (value not drawn)
C54  885382207009  [C0603]  (value not drawn)
C55  885382207009  [C0603]  (value not drawn)
C56  885382207009  [C0603]  (value not drawn)
R94  value 59.4  [R0603]  (hidden comment: Resistor)
R95  value 59.4  [R0603]  (hidden comment: Resistor)
R96  value 59.4  [R0603]  (hidden comment: Resistor)
R97  value 59.4  [R0603]  (hidden comment: Resistor)
T1  SM91502ALE  [FP-SM91502ALE-MFG]
T2  SM91502ALE  [FP-SM91502ALE-MFG]

### Nets
GND: C53.1 C54.2 C55.1 C56.2
ISO_Ix_A_N: R95.2 T1.3
ISO_Ix_A_P: R94.1 T1.1
ISO_Ix_B_N: R97.2 T2.3
ISO_Ix_B_P: R96.1 T2.1
ISO_xA_A_N: T1.4
ISO_xA_A_P: T1.6
ISO_xA_B_N: T2.4
ISO_xA_B_P: T2.6
NetC53_2: C53.2 R94.2 R95.1
NetC54_1: C54.1 T1.2
NetC55_2: C55.2 R96.2 R97.1
NetC56_1: C56.1 T2.2

Not connected (* = marked no-connect by the designer): T1 5*; T2 5*

### Layout directives
differential pair: ISO_Ix_A_N, ISO_Ix_A_P, ISO_Ix_B_N, ISO_Ix_B_P, ISO_xA_A_N, ISO_xA_A_P, ISO_xA_B_N, ISO_xA_B_P

### Notes on the sheet
- To upstream BMS slave (or master)
- (near C53) DNP
- (near C54) DNP
- To downstream BMS slave
- (near C55) DNP
- (near C56) DNP
- FOLLOW DATASHEET LAYOUT GUIDELINES!
- KEEP AREA UNDERNEATH TRANSFORMER EMPTY
- BMS Slave isoSPI Sheet
- Spartan Racing & SJSU
- A
- Vincent Pham, Vincent Saw

### Library data of the parts
C53-C56 = 885382207009: as C0 on sheet bmsSlave_cells; Mouser Part Number: 710-885382207009; Mouser Price/Stock: https://www.mouser.co.uk/ProductDetail/Wurth-Elektronik/885382207009?qs=0lSvoLzn4L%2FLliJ98PmFYg%3D%3D; Manufacturer_Part_Number: 885382207009; Datasheet Link: https://katalog.we-online.com/pbs/datasheet/885382207009.pdf
R94-R97 = Resistor: TC1: 0; SimulationGenericComponent: True; TC2: 0
T1 T2 = CMP-07264-000001-1: BMS XFORMER 1-CH 1000V AECQ +125; Manufacturer: Bourns; Standoff Height: 0.13mm; Turns Ratio: 1:1; Automotive Grade: Grade 1; Isolation Voltage: 4300VDC; Return Loss: -22dB; Insertion Loss: -0.25dB; Height: 5.72mm; Automotive: Yes; Package: 0; Device Class L3: unset; ComponentLink2Description: Datasheet; Category: Trans; ComponentLink2URL: https://www.bourns.com/docs/product-datasheets/SM91502AL.pdf; Device Class L1: Passive Components; Manufacturer Part Number: SM91502ALE; Temperature Range High: +125°C; Digikey Description: BMS XFORMER 1-CH 1000V AECQ +125; RoHS: TRUE; Lead Free: Yes; Octopart: https://octopart.com/sm91502ale-bourns-95732123; Device Class L2: Transformers; Temperature: -40°C to +125°C; Temperature Range Low: -40°C

## Nets that join several sheets
GND: bmsSlave_main (22 pins), bmsSlave_conn (J3.1 J4.1), bmsSlave_cells (22 pins), bmsSlave_isospi (C53.1 C54.2 C55.1 C56.2)
C1: bmsSlave_main (U1.36), bmsSlave_cells (C21.2 R38.1 Z1.1 Z2.2)
C2: bmsSlave_main (U1.34), bmsSlave_cells (C18.2 R26.1 Z2.1 Z3.2)
C3: bmsSlave_main (U1.32), bmsSlave_cells (C15.2 R14.1 Z3.1 Z4.2)
C4: bmsSlave_main (U1.30), bmsSlave_cells (C12.2 R2.1 Z4.1 Z5.2)
C5: bmsSlave_main (U1.28), bmsSlave_cells (C8.2 R3.1 Z5.1 Z6.2)
C6: bmsSlave_main (U1.26), bmsSlave_cells (C35.2 R66.1 Z6.1 Z7.2)
C7: bmsSlave_main (U1.24), bmsSlave_cells (C31.2 R58.1 Z7.1 Z8.2)
C8: bmsSlave_main (U1.22), bmsSlave_cells (C26.2 R44.1 Z8.1 Z9.2)
C9: bmsSlave_main (U1.20), bmsSlave_cells (C17.2 R27.1 Z9.1 Z10.2)
C10: bmsSlave_main (U1.18), bmsSlave_cells (C9.2 R4.1 Z10.1 Z11.2)
C11: bmsSlave_main (U1.16), bmsSlave_cells (C36.2 R67.1 Z11.1 Z12.2)
C12: bmsSlave_main (U1.14), bmsSlave_cells (C32.2 R59.1 Z12.1 Z13.2)
C13: bmsSlave_main (U1.12), bmsSlave_cells (C27.2 R45.1 Z13.1 Z14.2)
C14: bmsSlave_main (U1.10), bmsSlave_cells (C19.2 R28.1 Z14.1 Z15.2)
C15: bmsSlave_main (U1.8), bmsSlave_cells (C10.2 R6.1 Z15.1 Z16.2)
C16: bmsSlave_main (U1.6), bmsSlave_cells (C28.2 R47.1 Z16.1 Z17.2)
C17: bmsSlave_main (U1.4), bmsSlave_cells (C20.2 R30.1 Z17.1 Z18.2)
C18: bmsSlave_main (U1.2), bmsSlave_cells (C11.2 R7.1 Z18.1)
Cell1: bmsSlave_conn (J4.2), bmsSlave_cells (F1.1)
Cell2: bmsSlave_conn (J4.3), bmsSlave_cells (F2.1)
Cell3: bmsSlave_conn (J4.4), bmsSlave_cells (F3.1)
Cell4: bmsSlave_conn (J4.5), bmsSlave_cells (F4.1)
Cell5: bmsSlave_conn (J4.6), bmsSlave_cells (F5.1)
Cell6: bmsSlave_conn (J4.7), bmsSlave_cells (F6.1)
Cell7: bmsSlave_conn (J4.8), bmsSlave_cells (F7.1)
Cell8: bmsSlave_conn (J4.9), bmsSlave_cells (F8.1)
Cell9: bmsSlave_conn (J4.10), bmsSlave_cells (F9.1)
Cell10: bmsSlave_conn (J4.11), bmsSlave_cells (F10.1)
Cell11: bmsSlave_conn (J4.12), bmsSlave_cells (F11.1)
Cell12: bmsSlave_conn (J4.13), bmsSlave_cells (F12.1)
Cell12_F: bmsSlave_main (R91.1), bmsSlave_cells (7 pins)
Cell13: bmsSlave_conn (J4.14), bmsSlave_cells (F13.1)
Cell14: bmsSlave_conn (J4.15), bmsSlave_cells (F14.1)
Cell14_F: bmsSlave_main (R90.1), bmsSlave_cells (7 pins)
Cell15: bmsSlave_conn (J4.16), bmsSlave_cells (F15.1)
Cell16: bmsSlave_conn (J4.17), bmsSlave_cells (F16.1)
Cell16_F: bmsSlave_main (R87.1), bmsSlave_cells (7 pins)
Cell17: bmsSlave_conn (J4.18), bmsSlave_cells (F17.1)
Cell18: bmsSlave_conn (J4.19), bmsSlave_cells (F18.1)
Cell18_F: bmsSlave_main (R84.1), bmsSlave_cells (C7.2 F18.2 Q18.2 R7.2)
GPIO1: bmsSlave_main (C47.1 R83.1 U1.39), bmsSlave_conn (J3.2)
GPIO2: bmsSlave_main (C46.1 R82.1 U1.40), bmsSlave_conn (J3.3)
GPIO3: bmsSlave_main (C45.1 R81.1 U1.41), bmsSlave_conn (J3.4)
GPIO4: bmsSlave_main (C44.1 R80.1 U1.42), bmsSlave_conn (J3.5)
GPIO5: bmsSlave_main (C43.1 R79.1 U1.43), bmsSlave_conn (J3.6)
GPIO6: bmsSlave_main (C42.1 R78.1 U1.44), bmsSlave_conn (J3.7)
GPIO7: bmsSlave_main (C41.1 R77.1 U1.45), bmsSlave_conn (J3.8)
GPIO8: bmsSlave_main (C40.1 R76.1 U1.46), bmsSlave_conn (J3.9)
GPIO9: bmsSlave_main (C39.1 R75.1 U1.47), bmsSlave_conn (J3.10)
ISO_Ix_A_N: bmsSlave_main (U1.61), bmsSlave_isospi (R95.2 T1.3)
ISO_Ix_A_P: bmsSlave_main (U1.62), bmsSlave_isospi (R94.1 T1.1)
ISO_Ix_B_N: bmsSlave_main (U1.63), bmsSlave_isospi (R97.2 T2.3)
ISO_Ix_B_P: bmsSlave_main (U1.64), bmsSlave_isospi (R96.1 T2.1)
ISO_xA_A_N: bmsSlave_conn (J1.2), bmsSlave_isospi (T1.4)
ISO_xA_A_P: bmsSlave_conn (J1.1), bmsSlave_isospi (T1.6)
ISO_xA_B_N: bmsSlave_conn (J2.2), bmsSlave_isospi (T2.4)
ISO_xA_B_P: bmsSlave_conn (J2.1), bmsSlave_isospi (T2.6)
S1: bmsSlave_main (U1.37), bmsSlave_cells (R1.1)
S2: bmsSlave_main (U1.35), bmsSlave_cells (R29.1)
S3: bmsSlave_main (U1.33), bmsSlave_cells (R17.1)
S4: bmsSlave_main (U1.31), bmsSlave_cells (R5.1)
S5: bmsSlave_main (U1.29), bmsSlave_cells (R9.1)
S6: bmsSlave_main (U1.27), bmsSlave_cells (R68.1)
S7: bmsSlave_main (U1.25), bmsSlave_cells (R60.1)
S8: bmsSlave_main (U1.23), bmsSlave_cells (R48.1)
S9: bmsSlave_main (U1.21), bmsSlave_cells (R31.1)
S10: bmsSlave_main (U1.19), bmsSlave_cells (R10.1)
S11: bmsSlave_main (U1.17), bmsSlave_cells (R69.1)
S12: bmsSlave_main (U1.15), bmsSlave_cells (R61.1)
S13: bmsSlave_main (U1.13), bmsSlave_cells (R50.1)
S14: bmsSlave_main (U1.11), bmsSlave_cells (R33.1)
S15: bmsSlave_main (U1.9), bmsSlave_cells (R12.1)
S16: bmsSlave_main (U1.7), bmsSlave_cells (R51.1)
S17: bmsSlave_main (U1.5), bmsSlave_cells (R34.1)
S18: bmsSlave_main (U1.3), bmsSlave_cells (R13.1)